# EasyEDA schematic SCH_axp173+3a3036_2022-11-21.json
TITLE: Sheet_1; REV: 1.0; Date: 2022-08-19; Sheet: 1/1; Drawn By: liuzewen; Company: Your Company
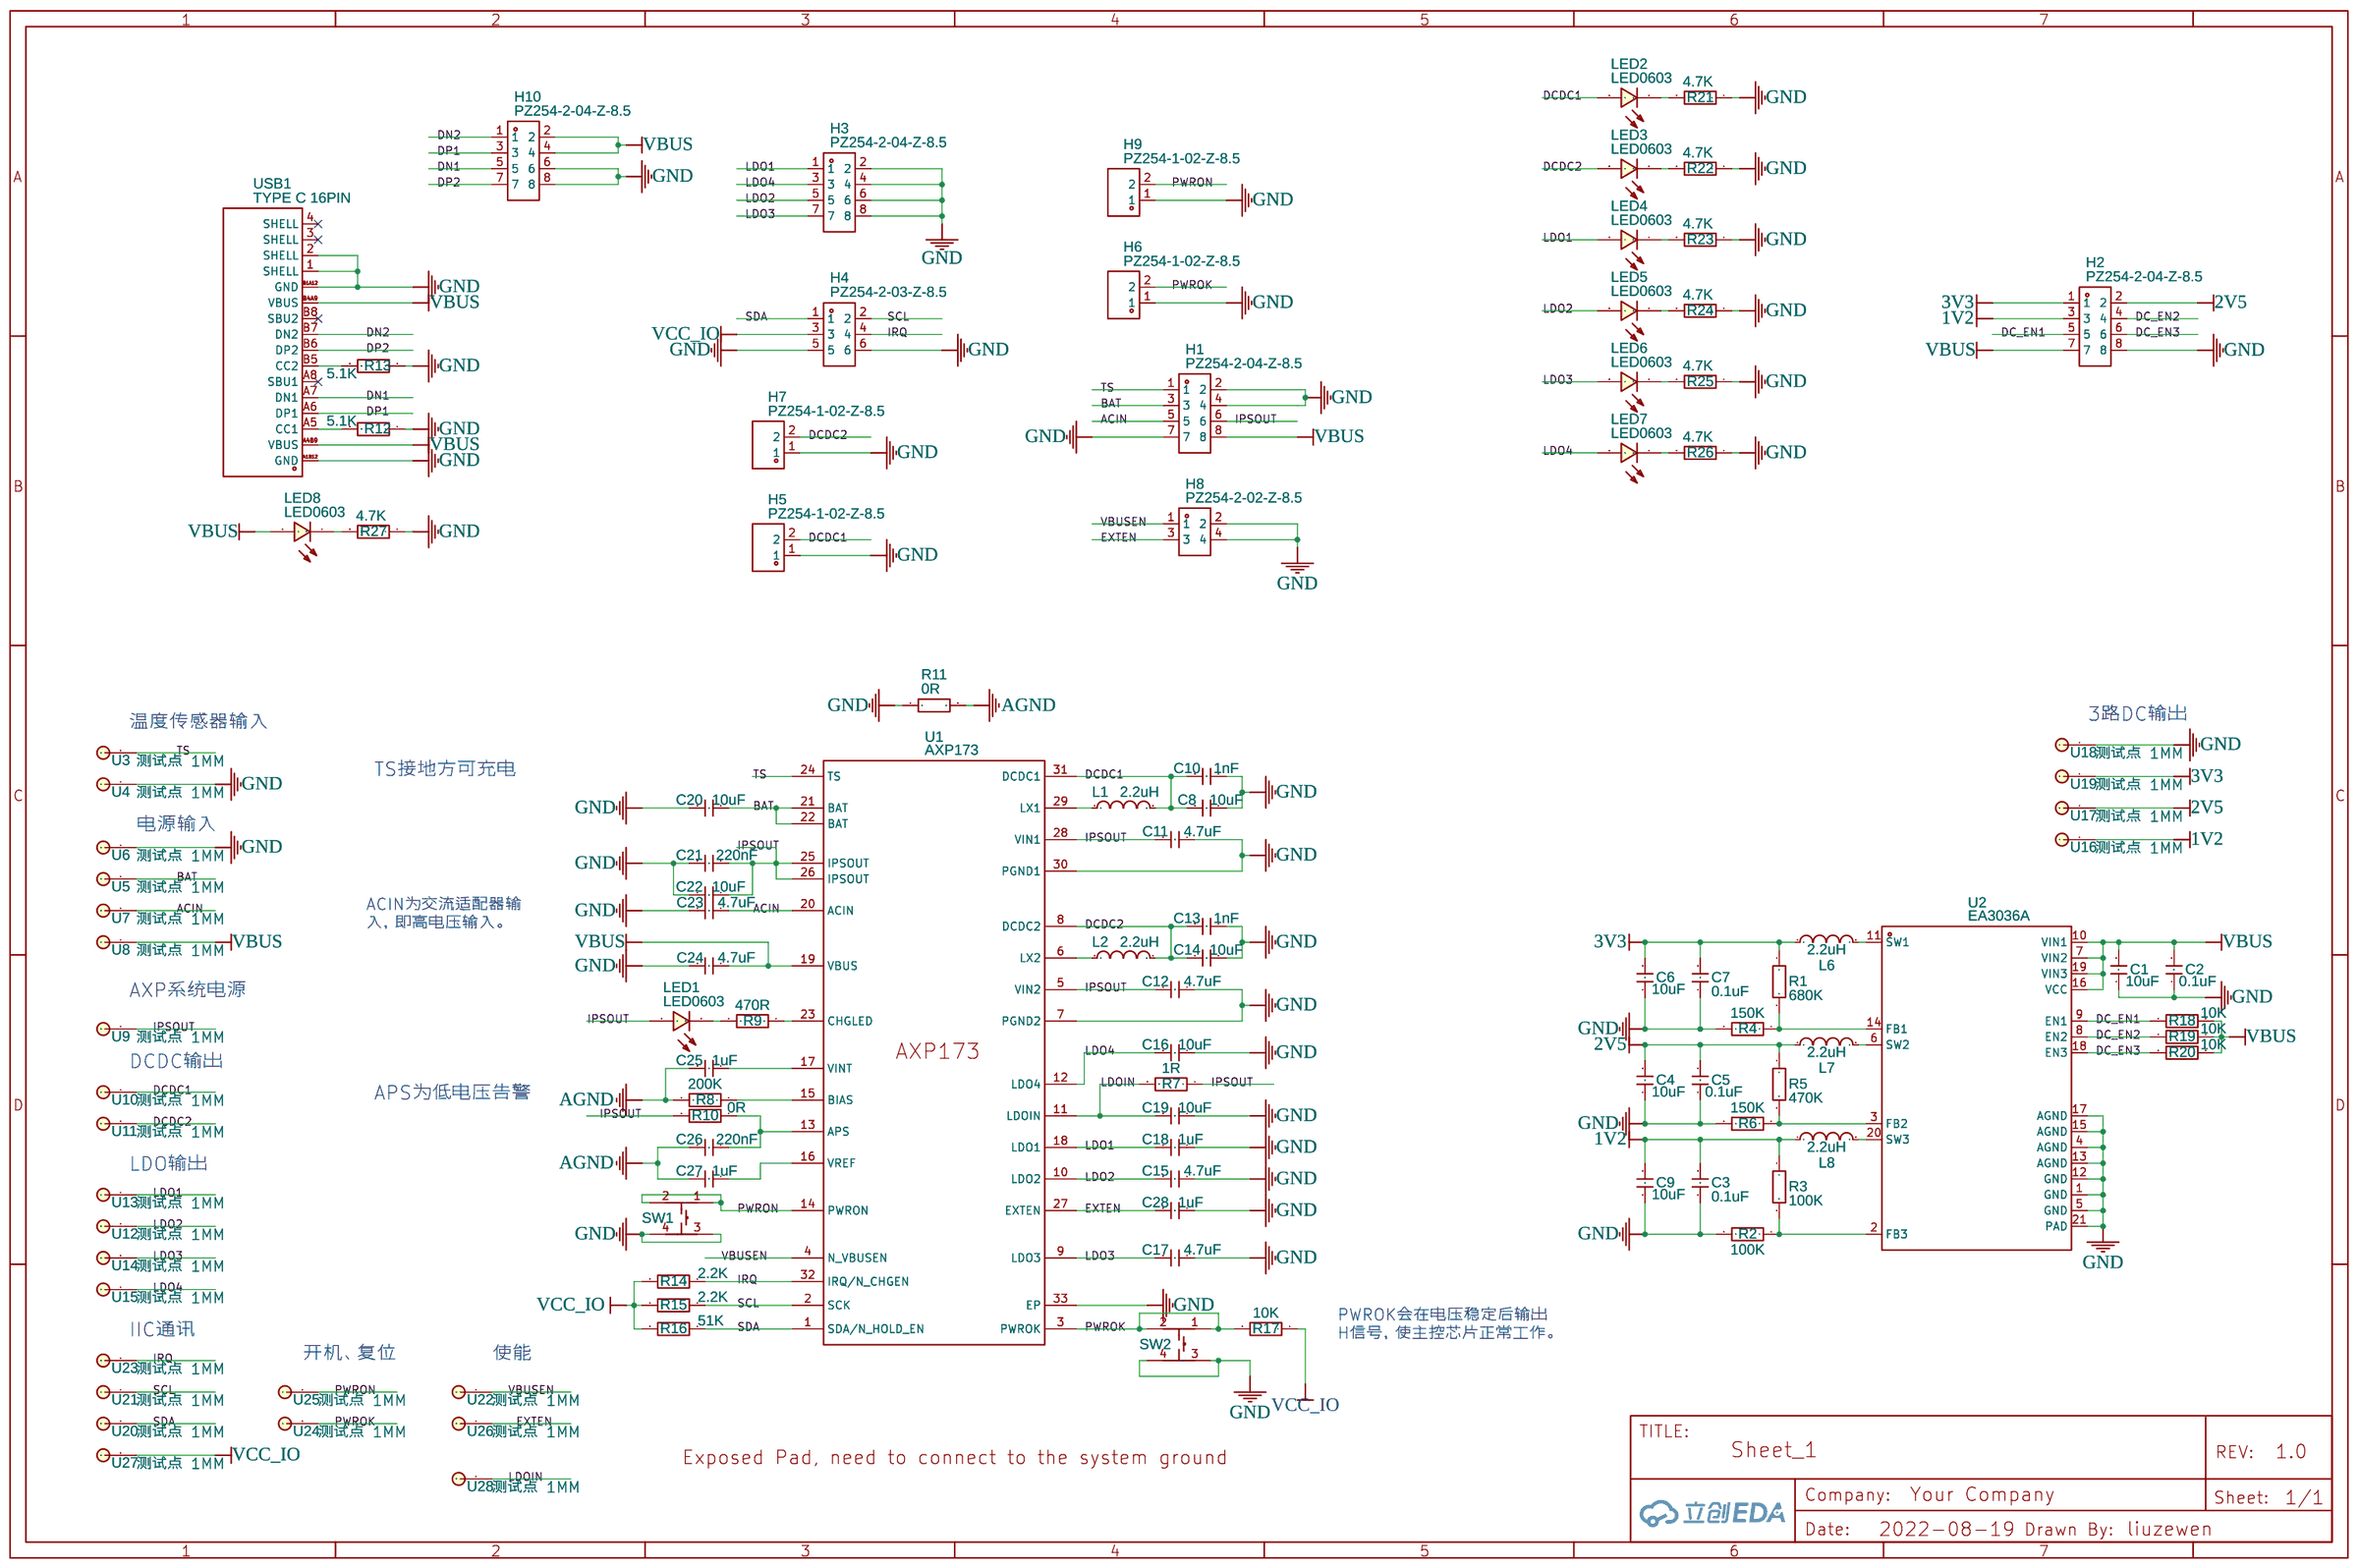
[diagram p0: schematic sheet]

## Parts
C1  10uF  [C0603-1]
C2  0.1uF  [C0603-1]
C3  0.1uF  [C0603-1]
C4  10uF  [C0603-1]
C5  0.1uF  [C0603-1]
C6  10uF  [C0603-1]
C7  0.1uF  [C0603-1]
C8  10uF  [C0603-1]
C9  10uF  [C0603-1]
C10  1nF  [C0603-1]
C11  4.7uF  [C0603-1]
C12  4.7uF  [C0603-1]
C13  1nF  [C0603-1]
C14  10uF  [C0603-1]
C15  4.7uF  [C0603-1]
C16  10uF  [C0603-1]
C17  4.7uF  [C0603-1]
C18  1uF  [C0603-1]
C19  10uF  [C0603-1]
C20  10uF  [C0603-1]
C21  220nF  [C0603-1]
C22  10uF  [C0603-1]
C23  4.7uF  [C0603-1]
C24  4.7uF  [C0603-1]
C25  1uF  [C0603-1]
C26  220nF  [C0603-1]
C27  1uF  [C0603-1]
C28  1uF  [C0603-1]
H1  PZ254-2-04-Z-8.5  [HDR-TH_8P-P2.54-V-M-R2-C4-S2.54]
H2  PZ254-2-04-Z-8.5  [HDR-TH_8P-P2.54-V-M-R2-C4-S2.54]
H3  PZ254-2-04-Z-8.5  [HDR-TH_8P-P2.54-V-M-R2-C4-S2.54]
H4  PZ254-2-03-Z-8.5  [HDR-TH_6P-P2.54-V-M-R2-C3-S2.54]
H5  PZ254-1-02-Z-8.5  [HDR-TH_2P-P2.54-V-M]
H6  PZ254-1-02-Z-8.5  [HDR-TH_2P-P2.54-V-M]
H7  PZ254-1-02-Z-8.5  [HDR-TH_2P-P2.54-V-M]
H8  PZ254-2-02-Z-8.5  [HDR-TH_4P-P2.54-V-M-R2-C2-S2.54]
H9  PZ254-1-02-Z-8.5  [HDR-TH_2P-P2.54-V-M]
H10  PZ254-2-04-Z-8.5  [HDR-TH_8P-P2.54-V-M-R2-C4-S2.54]
L1  2.2uH  [IND-SMD_L2.5-W2.0_FNR252012S]
L2  2.2uH  [IND-SMD_L2.5-W2.0_FNR252012S]
L6  2.2uH  [IND-SMD_L2.0-W1.6]
L7  2.2uH  [IND-SMD_L2.0-W1.6]
L8  2.2uH  [IND-SMD_L2.0-W1.6]
LED1  LED0603  [LED0603]
LED2  LED0603  [LED0603]
LED3  LED0603  [LED0603]
LED4  LED0603  [LED0603]
LED5  LED0603  [LED0603]
LED6  LED0603  [LED0603]
LED7  LED0603  [LED0603]
LED8  LED0603  [LED0603]
R1  680K  [R0603-1]
R2  100K  [R0603-1]
R3  100K  [R0603-1]
R4  150K  [R0603-1]
R5  470K  [R0603-1]
R6  150K  [R0603-1]
R7  1R  [R0603-1]
R8  200K  [R0603-1]
R9  470R  [R0603-1]
R10  0R  [R0603-1]
R11  0R  [R0603-1]
R12  5.1K  [R0603-1]
R13  5.1K  [R0603-1]
R14  2.2K  [R0603-1]
R15  2.2K  [R0603-1]
R16  51K  [R0603-1]
R17  10K  [R0603-1]
R18  10K  [R0603-1]
R19  10K  [R0603-1]
R20  10K  [R0603-1]
R21  4.7K  [R0603-1]
R22  4.7K  [R0603-1]
R23  4.7K  [R0603-1]
R24  4.7K  [R0603-1]
R25  4.7K  [R0603-1]
R26  4.7K  [R0603-1]
R27  4.7K  [R0603-1]
SW1  UK-B0267-SP25Y  [KEY-SMD_4P-L4.2-W3.2-P2.20-LS5.1-TL]
SW2  UK-B0267-SP25Y  [KEY-SMD_4P-L4.2-W3.2-P2.20-LS5.1-TL]
U1  AXP173  [QFN-32L-EP-5X5]
U2  EA3036A  [WQFN-20_L3.0-W3.0-P0.40-BL-EP1.7]
U3  测试点 1MM  [测试点 1MM]
U4  测试点 1MM  [测试点 1MM]
U5  测试点 1MM  [测试点 1MM]
U6  测试点 1MM  [测试点 1MM]
U7  测试点 1MM  [测试点 1MM]
U8  测试点 1MM  [测试点 1MM]
U9  测试点 1MM  [测试点 1MM]
U10  测试点 1MM  [测试点 1MM]
U11  测试点 1MM  [测试点 1MM]
U12  测试点 1MM  [测试点 1MM]
U13  测试点 1MM  [测试点 1MM]
U14  测试点 1MM  [测试点 1MM]
U15  测试点 1MM  [测试点 1MM]
U16  测试点 1MM  [测试点 1MM]
U17  测试点 1MM  [测试点 1MM]
U18  测试点 1MM  [测试点 1MM]
U19  测试点 1MM  [测试点 1MM]
U20  测试点 1MM  [测试点 1MM]
U21  测试点 1MM  [测试点 1MM]
U22  测试点 1MM  [测试点 1MM]
U23  测试点 1MM  [测试点 1MM]
U24  测试点 1MM  [测试点 1MM]
U25  测试点 1MM  [测试点 1MM]
U26  测试点 1MM  [测试点 1MM]
U27  测试点 1MM  [测试点 1MM]
U28  测试点 1MM  [测试点 1MM]
USB1  TYPE C 16PIN  [TYPE C 16P - 有定位孔]

## Library data of the parts
C1-C28 = C0603: Contributor: liuzewen
H1-H3 H10 = PZ254-2-04-Z-8.5: Supplier: LCSC; Supplier Part: C2894965; Manufacturer: HCTL(华灿天禄); Contributor: LCSC; JLCPCB Part Class: Extended Part
H4 = PZ254-2-03-Z-8.5: Supplier: LCSC; Supplier Part: C2894964; Manufacturer: HCTL(华灿天禄); Contributor: LCSC; JLCPCB Part Class: Extended Part
H5-H7 H9 = PZ254-1-02-Z-8.5: Supplier: LCSC; Supplier Part: C2894925; Manufacturer: HCTL(华灿天禄); Contributor: LCSC; JLCPCB Part Class: Extended Part
H8 = PZ254-2-02-Z-8.5: Supplier: LCSC; Supplier Part: C2894963; Manufacturer: HCTL(华灿天禄); Contributor: LCSC; JLCPCB Part Class: Extended Part
L1 L2 = FNR252010S2R2NT: Supplier: LCSC; Manufacturer: cjiang; Contributor: LCSC; Supplier Part: C167682; JLCPCB Part Class: Extended Part
L6-L8 = CKCS201610-2.2UH/M-N: Supplier: LCSC; Supplier Part: C354533; Manufacturer: CENKER; Manufacturer Part: CKCS201610-2.2uH/M-N; Contributor: LCSC
LED1-LED8 = LED0603: Contributor: liuzewen
R1-R27 = R0603: Contributor: liuzewen; Package Display: No
SW1 SW2 = UK-B0267-SP25Y: Supplier: LCSC; Supplier Part: C493283; Manufacturer: USAKRO; Contributor: LCSC
U1 = AXP173: sourceId: r8gysmEWQ; Contributor: eggfly; Supplier: LCSC; Manufacturer: X-powers; Manufacturer Part: AXP209; LCSC Assembly: Yes; SMT Type: Extend
U2 = EA3036A: Contributor: GloomyGhost
U3-U28 = 测试点 1MM: Contributor: liuzewen
USB1 = TYPE C 16PIN: Supplier: LCSC; Supplier Part: C393939; Manufacturer: SHOU HAN; Manufacturer Part: TYPE-C16PIN; Contributor: liuzewen

## Nets
1V2: C3.2 C9.2 H2.3 L8.1 R3.1 U16.1
2V5: C4.2 C5.2 H2.2 L7.1 R5.1 U17.1
3V3: C6.2 C7.2 H2.1 L6.1 R1.1 U19.1
AGND: C25.2 C26.2 C27.2 R8.2 R11.2
GND: C1.1 C2.1 C3.1 C4.1 C5.1 C6.1 C7.1 C8.1 C9.1 C10.1 C11.1 C12.1 C13.1 C14.1 C15.1 C16.1 C17.1 C18.1 C19.1 C20.2 C21.2 C22.2 C23.2 C24.2 C28.1 H1.2 H1.4 H1.7 H2.8 H3.2 H3.4 H3.6 H3.8 H4.5 H4.6 H5.1 H6.1 H7.1 H8.2 H8.4 H9.1 H10.6 H10.8 R2.2 R4.2 R6.2 R11.1 R12.1 R13.1 R21.1 R22.1 R23.1 R24.1 R25.1 R26.1 R27.1 SW1.3 SW1.4 SW2.3 SW2.4 U1.7(PGND2) U1.30(PGND1) U1.33(EP) U2.1(GND) U2.4(AGND) U2.5(GND) U2.12(GND) U2.13(AGND) U2.15(AGND) U2.17(AGND) U2.21(PAD) U4.1 U6.1 U18.1 USB1.1(SHELL) USB1.2(SHELL) USB1.A1B12(GND) USB1.B1A12(GND)
VBUS: C1.2 C2.2 C24.1 H1.8 H2.7 H10.2 H10.4 LED8.2(A) R18.1 R19.1 R20.1 U1.19(VBUS) U2.7(VIN2) U2.10(VIN1) U2.16(VCC) U2.19(VIN3) U8.1 USB1.A4B9(VBUS) USB1.B4A9(VBUS)
VBUSEN: H8.1 U1.4(N_VBUSEN) U22.1
VCC_IO: H4.3 R14.2 R15.2 R16.2 R17.1 U27.1
ACIN: C23.1 H1.5 U1.20(ACIN) U7.1
BAT: C20.1 H1.3 U1.21(BAT) U1.22(BAT) U5.1
DC_EN1: H2.5 R18.2 U2.9(EN1)
DC_EN2: H2.4 R19.2 U2.8(EN2)
DC_EN3: H2.6 R20.2 U2.18(EN3)
DCDC1: C8.2 C10.2 H5.2 L1.2 LED2.2(A) U1.31(DCDC1) U10.1
DCDC2: C13.2 C14.2 H7.2 L2.2 LED3.2(A) U1.8(DCDC2) U11.1
DN1: H10.5 USB1.A7(DN1)
DN2: H10.1 USB1.B7(DN2)
DP1: H10.3 USB1.A6(DP1)
DP2: H10.7 USB1.B6(DP2)
EXTEN: C28.2 H8.3 U1.27(EXTEN) U26.1
IPSOUT: C11.2 C12.2 C21.1 C22.1 H1.6 LED1.2(A) R7.1 R10.2 U1.5(VIN2) U1.25(IPSOUT) U1.26(IPSOUT) U1.28(VIN1) U9.1
IRQ: H4.4 R14.1 U1.32(IRQ/N_CHGEN) U23.1
LDO1: C18.2 H3.1 LED4.2(A) U1.18(LDO1) U13.1
LDO2: C15.2 H3.5 LED5.2(A) U1.10(LDO2) U12.1
LDO3: C17.2 H3.7 LED6.2(A) U1.9(LDO3) U14.1
LDO4: C16.2 H3.3 LED7.2(A) U1.12(LDO4) U15.1
LDOIN: C19.2 R7.2 U1.11(LDOIN) U28.1
PWROK: H6.2 R17.2 SW2.1 SW2.2 U1.3(PWROK) U24.1
PWRON: H9.2 SW1.1 SW1.2 U1.14(PWRON) U25.1
SCL: H4.2 R15.1 U1.2(SCK) U21.1
SDA: H4.1 R16.1 U1.1(SDA/N_HOLD_EN) U20.1
TS: H1.1 U1.24(TS) U3.1
Net-(C25-1): C25.1 U1.17(VINT)
Net-(C26-1): C26.1 R10.1 U1.13(APS)
Net-(C27-1): C27.1 U1.16(VREF)
Net-(L1-1): L1.1 U1.29(LX1)
Net-(L2-1): L2.1 U1.6(LX2)
Net-(L6-2): L6.2 U2.11(SW1)
Net-(L7-2): L7.2 U2.6(SW2)
Net-(L8-2): L8.2 U2.20(SW3)
Net-(LED1-1): LED1.1(C) R9.2
Net-(LED2-1): LED2.1(C) R21.2
Net-(LED3-1): LED3.1(C) R22.2
Net-(LED4-1): LED4.1(C) R23.2
Net-(LED5-1): LED5.1(C) R24.2
Net-(LED6-1): LED6.1(C) R25.2
Net-(LED7-1): LED7.1(C) R26.2
Net-(LED8-1): LED8.1(C) R27.2
Net-(R1-2): R1.2 R4.1 U2.14(FB1)
Net-(R2-1): R2.1 R3.2 U2.2(FB3)
Net-(R5-2): R5.2 R6.1 U2.3(FB2)
Net-(R8-1): R8.1 U1.15(BIAS)
Net-(R9-1): R9.1 U1.23(CHGLED)
Net-(R12-2): R12.2 USB1.A5(CC1)
Net-(R13-2): R13.2 USB1.B5(CC2)

Not connected (* = marked no-connect by the designer): USB1 3(SHELL)* 4(SHELL)* A8(SBU1)* B8(SBU2)*

## Notes on the sheet
- 3路DC输出
- 温度传感器输入
- TS接地方可充电
- 电源输入
- ACIN为交流适配器输
  入，即高电压输入。
- AXP系统电源
- DCDC输出
- APS为低电压告警
- LDO输出
- IIC通讯
- PWROK会在电压稳定后输出
  H信号，使主控芯片正常工作。
- 开机、复位
- 使能
